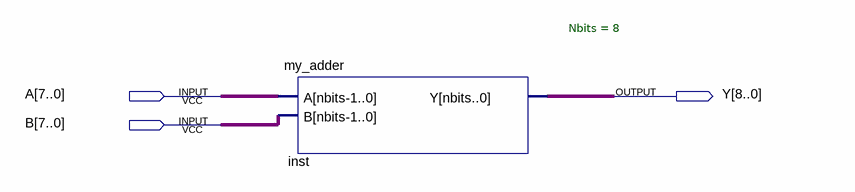
[diagram p0: schematic sheet]
// Quartus schematic behavioural.bdf as structural Verilog: 1 symbols, 3 pins
module behavioural (
  input  [7:0] A,
  input  [7:0] B,
  output [8:0] Y
);

  my_adder #(.Nbits(8)) inst (.A(A), .B(B), .Y(Y));
endmodule
